# EAGLE schematic smart solar (EAGLE 9.6.2)
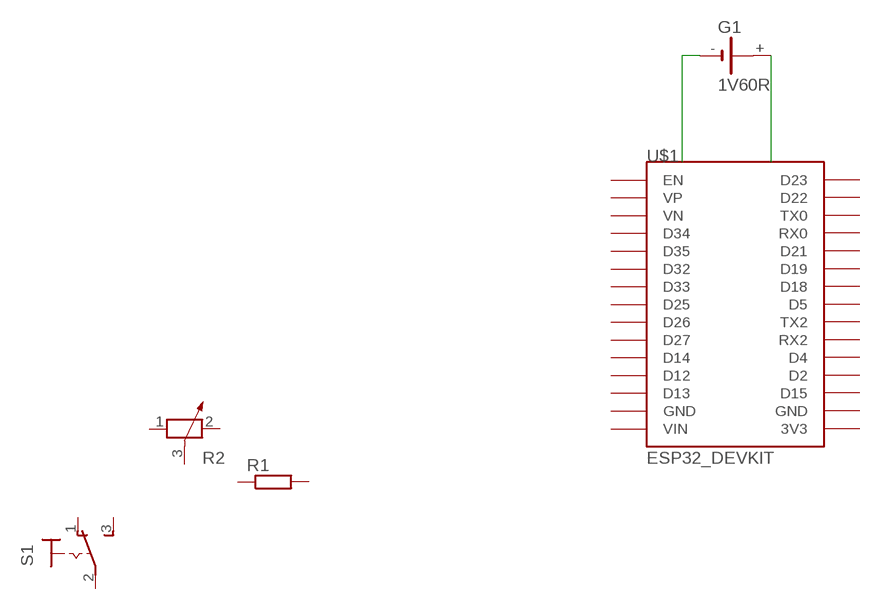
[diagram p0: schematic, sheet 1]

## Parts
G1  1V60R  [1V60R]
R1  R-EU_0207/7  [0207/7]
R2  POTENTIOMETER_PT-10S  [PT-10S]
S1  320-916  [320-916]
U$1  ESP32_DEVKIT  [ESP32_DEVKIT]

## Nets
N$1: G1.-
N$2: G1.+
Unconnected: G1.+@1(+) R1.1 R1.2 R2.1 R2.2 R2.3 S1.1(O) S1.2(P) S1.3(S) U$1.3V3 U$1.D2 U$1.D4 U$1.D5 U$1.D12 U$1.D13 U$1.D14 U$1.D15 U$1.D18 U$1.D19 U$1.D21 U$1.D22 U$1.D23 U$1.D25 U$1.D26 U$1.D27 U$1.D32 U$1.D33 U$1.D34 U$1.D35 U$1.EN U$1.GND@1(GND) U$1.GND@2(GND) U$1.RX0 U$1.RX2 U$1.TX0 U$1.TX2 U$1.VIN U$1.VN U$1.VP

## Library data of the parts
G1 = battery:1V60R: NC ACCU Varta
R1 = rcl:R-EU_: RESISTOR, European symbol; SPICEPREFIX: R
R2 = rcl:POTENTIOMETER_: Potentiometer; SPICEMODEL: POT; SPICEPREFIX: X
S1 = switch:320-916: TOGGLE SWITCH distributor RS Components
U$1 = DOIT_ESP32_DEVKIT:ESP32_DEVKIT: ESP32 DEVKIT BOARD